# Altium schematic sheet Scoreboard.SchDoc
size A; SheetNumber: 1; SheetTotal: 2
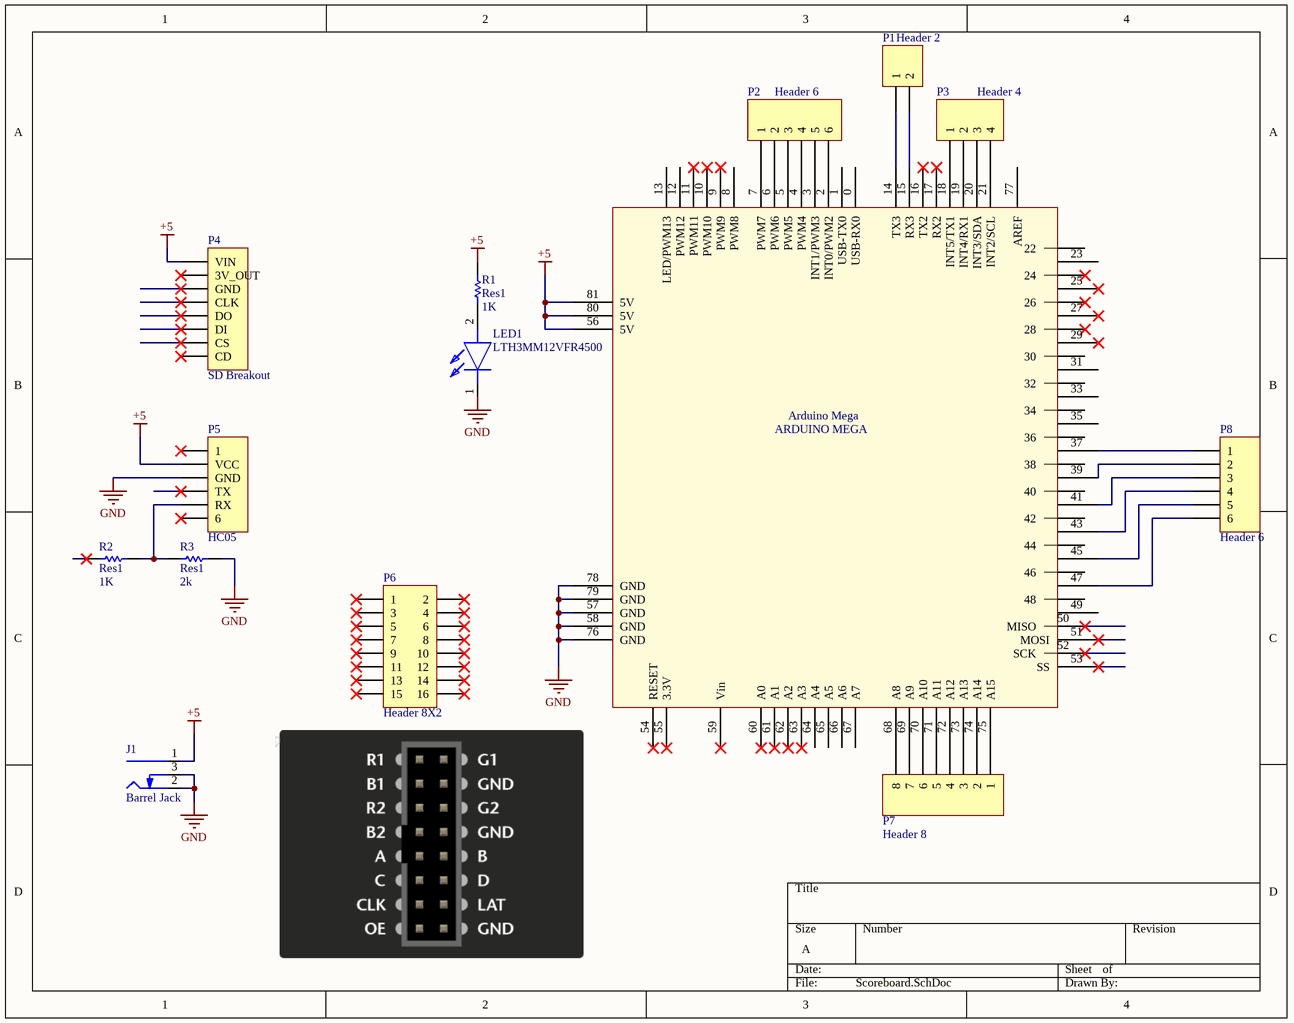
[diagram p0: Scoreboard.SchDoc]

## Parts
Arduino_Mega  ARDUINO MEGA  [ARDUINO MEGA]
J1  Barrel Jack  [PCB - CONNECTOR - BARREL - CUI PJ-102]
LED1  LTH3MM12VFR4500  [LTH3MM12VFR4500]
P1  Header 2  [HDR1X2]
P2  Header 6  [HDR1X6]
P3  Header 4  [HDR1X4]
P4  SD Breakout  [HDR1X8]
P5  HC05  [HDR1X6]
P6  Header 8X2  [HDR2X8]
P7  Header 8  [HDR1X8]
P8  Header 6  [HDR1X6]
R1  Res1  value 1K  [AXIAL-0.3]
R2  Res1  value 1K  [AXIAL-0.3]
R3  Res1  value 2k  [AXIAL-0.3]

## Nets
+5: Arduino_Mega.56(5V) Arduino_Mega.80(5V) Arduino_Mega.81(5V) J1.1(Centre) P4.1(VIN) P5.2(VCC) R1.2
GND: Arduino_Mega.57(GND) Arduino_Mega.58(GND) Arduino_Mega.76(GND) Arduino_Mega.78(GND) Arduino_Mega.79(GND) J1.2(Outer) J1.3(SW) LED1.1(K) P5.3(GND) R3.2
NetArduino_Mega_2: Arduino_Mega.2(INT0/PWM2) P2.6
NetArduino_Mega_3: Arduino_Mega.3(INT1/PWM3) P2.5
NetArduino_Mega_4: Arduino_Mega.4(PWM4) P2.4
NetArduino_Mega_5: Arduino_Mega.5(PWM5) P2.3
NetArduino_Mega_6: Arduino_Mega.6(PWM6) P2.2
NetArduino_Mega_7: Arduino_Mega.7(PWM7) P2.1
NetArduino_Mega_14: Arduino_Mega.14(TX3) P1.1
NetArduino_Mega_15: Arduino_Mega.15(RX3) P1.2
NetArduino_Mega_18: Arduino_Mega.18(INT5/TX1) P3.1
NetArduino_Mega_19: Arduino_Mega.19(INT4/RX1) P3.2
NetArduino_Mega_20: Arduino_Mega.20(INT3/SDA) P3.3
NetArduino_Mega_21: Arduino_Mega.21(INT2/SCL) P3.4
NetArduino_Mega_37: Arduino_Mega.37 P8.1
NetArduino_Mega_39: Arduino_Mega.39 P8.2
NetArduino_Mega_41: Arduino_Mega.41 P8.3
NetArduino_Mega_43: Arduino_Mega.43 P8.4
NetArduino_Mega_45: Arduino_Mega.45 P8.5
NetArduino_Mega_47: Arduino_Mega.47 P8.6
NetArduino_Mega_68: Arduino_Mega.68(A8) P7.8
NetArduino_Mega_69: Arduino_Mega.69(A9) P7.7
NetArduino_Mega_70: Arduino_Mega.70(A10) P7.6
NetArduino_Mega_71: Arduino_Mega.71(A11) P7.5
NetArduino_Mega_72: Arduino_Mega.72(A12) P7.4
NetArduino_Mega_73: Arduino_Mega.73(A13) P7.3
NetArduino_Mega_74: Arduino_Mega.74(A14) P7.2
NetArduino_Mega_75: Arduino_Mega.75(A15) P7.1
NetLED1_2: LED1.2(A) R1.1
NetP5_5: P5.5(RX) R2.1 R3.1

Not connected (* = marked no-connect by the designer): Arduino_Mega 0(USB-RX0) 1(USB-TX0) 8(PWM8) 9(PWM9)* 10(PWM10)* 11(PWM11)* 12(PWM12) 13(LED/PWM13) 16(TX2)* 17(RX2)* 22 23 24* 25* 26* 27* 28* 29* 30 31 32 33 34 35 36 38 40 42 44 46 48 49 50(MISO)* 51(MOSI)* 52(SCK)* 53(SS)* 54(RESET)* 55(3.3V)* 59(Vin)* 60(A0)* 61(A1)* 62(A2)* 63(A3)* 64(A4) 65(A5) 66(A6) 67(A7) 77(AREF); P4 2(3V_OUT)* 3(GND)* 4(CLK)* 5(DO)* 6(DI)* 7(CS)* 8(CD)*; P5 1* 4(TX)* 6*; P6 1* 2* 3* 4* 5* 6* 7* 8* 9* 10* 11* 12* 13* 14* 15* 16*; R2 2*

## Library data of the parts
J1 = 1341: Power Barrel Connector Jack 2.50mm ID (0.098&quot;), 5.50mm OD (0.217&quot;) Through Hole, Right Angle; Rowan Part Number: 1341; Manufacturer: CUI Devices; Manufacturer part number: PJ-102B; Name: Barrel Jack 2.5mmx5.5mm; Supplier 1: Digi-Key; Supplier Part Number 1: CP-102B-ND; Category: Connectors; Datasheet: https://www.cuidevices.com/product/resource/digikeypdf/pj-102b.pdf; Status: Active
LED1 = LTH3MM12VFR4500: LED RED; Manufacturer_Name: Visual Communications Company; Datasheet Link: https://vcclite.com/wp-content/uploads/wpallimport/files/files/LTH3MM12VFR4500.pdf; Height: 5.55mm; Manufacturer_Part_Number: LTH3MM12VFR4500; Mouser Part Number: 593-LTH3MM12VFR4500; Mouser Price/Stock: https://www.mouser.co.uk/ProductDetail/VCC/LTH3MM12VFR4500?qs=Mv7BduZupUhMUueo6XymDw%3D%3D; Arrow Part Number: LTH3MM12VFR4500; Arrow Price/Stock: https://www.arrow.com/en/products/lth3mm12vfr4500/visual-communications?region=nac
P1 = Header 2: Header, 2-Pin; LatestRevisionDate: 17-Jul-2002; LatestRevisionNote: Re-released for DXP Platform.; Publisher: Altium Limited
P2 P5 P8 = Header 6: Header, 6-Pin; LatestRevisionDate: 17-Jul-2002; LatestRevisionNote: Re-released for DXP Platform.; Publisher: Altium Limited
P3 = Header 4: Header, 4-Pin; LatestRevisionDate: 17-Jul-2002; LatestRevisionNote: Re-released for DXP Platform.; Publisher: Altium Limited
P4 P7 = Header 8: Header, 8-Pin; LatestRevisionDate: 17-Jul-2002; LatestRevisionNote: Re-released for DXP Platform.; Publisher: Altium Limited
P6 = Header 8X2: Header, 8-Pin, Dual row; LatestRevisionDate: 17-Jul-2002; LatestRevisionNote: Re-released for DXP Platform.; Publisher: Altium Limited
R1-R3 = Res1: Resistor; Published: 8-Jun-2000; LatestRevisionDate: 17-Jul-2002; LatestRevisionNote: Re-released for DXP Platform.; PackageReference: AXIAL-0.3; Publisher: Altium Limited; PackageDescription: Axial Device, Thru-Hole; 2 Leads; 0.3 in Pin Spacing